# EAGLE design ledCtrl (EAGLE 6.4)
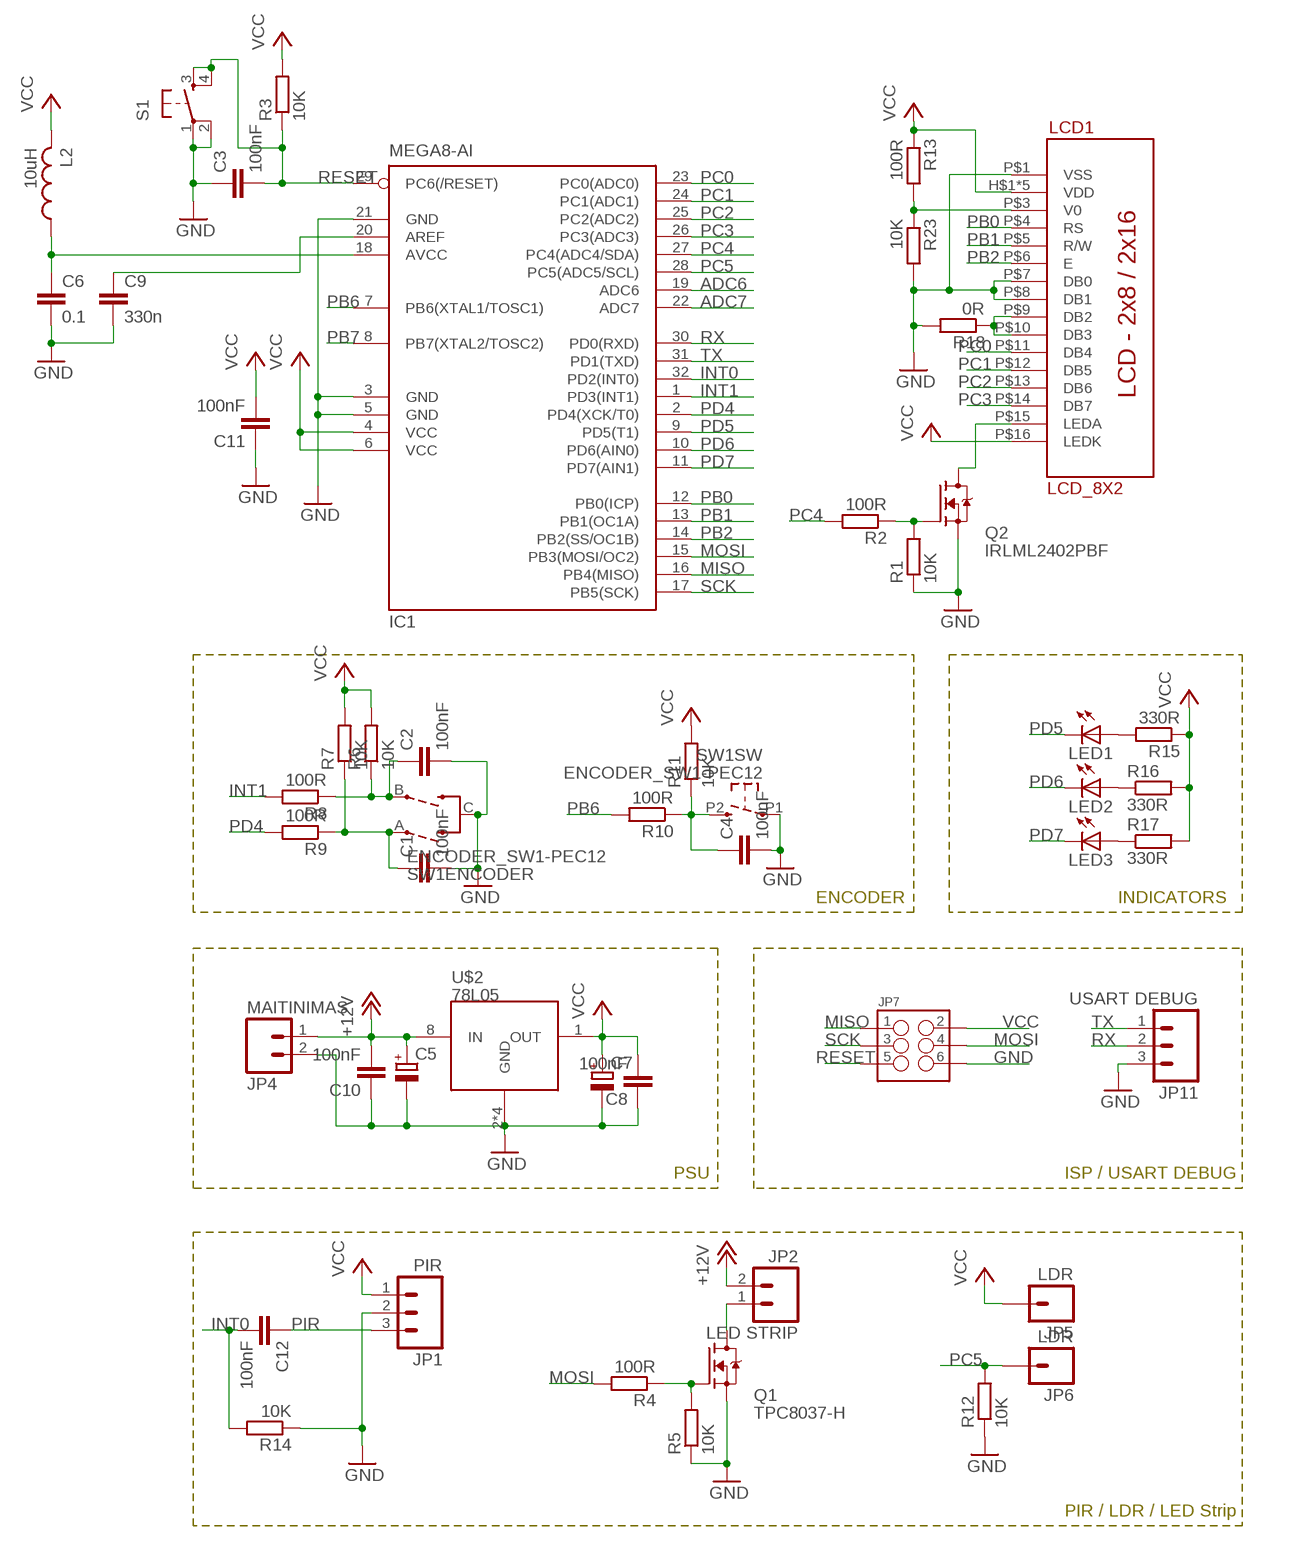
[diagram p0: schematic, sheet 1]

## Parts
C1  100nF  C-EUC0805  [C0805]
C2  100nF  C-EUC0805  [C0805]
C3  100nF  C-EUC0805  [C0805]
C4  100nF  C-EUC0805  [C0805]
C5  CPOL-EUSMCC  [SMC_C]
C6  0.1  C-EUC0805K  [C0805K]
C7  CPOL-EUSMCC  [SMC_C]
C8  100nF  C-EUC0805  [C0805]
C9  330n  C-EUC0805  [C0805]
C10  100nF  C-EUC0805  [C0805]
C11  100nF  C-EUC0805  [C0805]
C12  100nF  C-EUC0805  [C0805]
IC1  MEGA8-AI  [TQFP32-08]
JP1  PIR  M03LOCK  [1X03_LOCK]
JP2  LED STRIP  M023.5MM-NO_SILK  [SCREWTERMINAL-3.5MM-2-NS]
JP4  MAITINIMAS  M023.5MM-NO_SILK  [SCREWTERMINAL-3.5MM-2-NS]
JP5  LDR  M01PTH_LONGPAD  [1X01_LONGPAD]
JP6  LDR  M01PTH_LONGPAD  [1X01_LONGPAD]
JP7  M03X2  [2X3-SHROUDED]
JP11  USART DEBUG  M03LOCK  [1X03_LOCK]
L2  10uH  L-USL2825P  [L2825P]
LCD1  LCD_8X2  [LCD_2X8]
LED1  LEDCHIP-LED0805  [CHIP-LED0805]
LED2  LEDCHIP-LED0805  [CHIP-LED0805]
LED3  LEDCHIP-LED0805  [CHIP-LED0805]
Q1  TPC8037-H  [SO8]
Q2  IRLML2402PBF  [SOT23]
R1  10K  R-EU_M0805  [M0805]
R2  100R  R-EU_M0805  [M0805]
R3  10K  R-EU_M0805  [M0805]
R4  100R  R-EU_M0805  [M0805]
R5  10K  R-EU_M0805  [M0805]
R6  10K  R-EU_M0805  [M0805]
R7  10K  R-EU_M0805  [M0805]
R8  100R  R-EU_M0805  [M0805]
R9  100R  R-EU_M0805  [M0805]
R10  100R  R-EU_M0805  [M0805]
R11  10K  R-EU_M0805  [M0805]
R12  10K  R-EU_M1206  [M1206]
R13  100R  R-EU_M0805  [M0805]
R14  10K  R-EU_M0805  [M0805]
R15  330R  R-EU_M0805  [M0805]
R16  330R  R-EU_M0805  [M0805]
R17  330R  R-EU_M0805  [M0805]
R18  0R  R-EU_M1206  [M1206]
R23  10K  R-EU_M0805  [M0805]
S1  TAC_SWITCHPTH  [TACTILE-PTH]
SW1  ENCODER_SW1-PEC12  [PEC12_INCREMENTAL_ENCODER]
U$2  78L05  [SO8]

## Nets
+12V: C5.+ C10.2 JP2.2 JP4.1 U$2.8(IN)
ADC6: IC1.19(ADC6)
ADC7: IC1.22(ADC7)
AREF: C9.1 IC1.20(AREF)
AVCC: C6.1 IC1.18(AVCC) L2.1
GND: C1.2 C2.2 C3.1 C4.2 C5.- C6.2 C7.- C8.1 C9.2 C10.1 C11.1 IC1.3(GND) IC1.5(GND) IC1.21(GND) JP1.2 JP4.2 JP7.6 JP11.3 LCD1.P$1(VSS) LCD1.P$7(DB0) LCD1.P$8(DB1) Q1.1(S) Q1.2(S) Q1.3(S) Q2.2(S) R1.1 R5.1 R12.1 R14.1 R18.2 R23.2 S1.1 S1.2 SW1.C(ENCODER:C) SW1.P1 U$2.2(GND) U$2.3(GND) U$2.6(GND) U$2.7(GND)
INT0: C12.2 IC1.32(PD2(INT0)) R14.2
INT1: IC1.1(PD3(INT1)) R8.2
MISO: IC1.16(PB4(MISO)) JP7.1
MOSI: IC1.15(PB3(MOSI/OC2)) JP7.4 R4.2
N$1: JP2.1 Q1.5(D) Q1.6(D) Q1.7(D) Q1.8(D)
N$2: LED1.A R15.2
N$3: C2.1 R6.1 R8.1 SW1.B(ENCODER:B)
N$4: C1.1 R7.1 R9.1 SW1.A(ENCODER:A)
N$5: LED2.A R16.1
N$6: LED3.A R17.1
N$7: LCD1.P$15(LEDA) Q2.3(D)
N$8: Q2.1(G) R1.2 R2.1
N$11: Q1.4(G) R4.1 R5.2
N$12: C4.1 R10.1 R11.1 SW1.P2
N$15: LCD1.P$9(DB2) LCD1.P$10(DB3) R18.1
N$20: LCD1.P$3(V0) R13.2 R23.1
PB0: IC1.12(PB0(ICP)) LCD1.P$4(RS)
PB1: IC1.13(PB1(OC1A)) LCD1.P$5(R/W)
PB2: IC1.14(PB2(SS/OC1B)) LCD1.P$6(E)
PB6: IC1.7(PB6(XTAL1/TOSC1)) R10.2
PB7: IC1.8(PB7(XTAL2/TOSC2))
PC0: IC1.23(PC0(ADC0)) LCD1.P$11(DB4)
PC1: IC1.24(PC1(ADC1)) LCD1.P$12(DB5)
PC2: IC1.25(PC2(ADC2)) LCD1.P$13(DB6)
PC3: IC1.26(PC3(ADC3)) LCD1.P$14(DB7)
PC4: IC1.27(PC4(ADC4/SDA)) R2.2
PC5: IC1.28(PC5(ADC5/SCL)) JP6.1 R12.2
PD4: IC1.2(PD4(XCK/T0)) R9.2
PD5: IC1.9(PD5(T1)) LED1.C
PD6: IC1.10(PD6(AIN0)) LED2.C
PD7: IC1.11(PD7(AIN1)) LED3.C
PIR: C12.1 JP1.3
RESET: C3.2 IC1.29(PC6(/RESET)) JP7.5 R3.1 S1.3 S1.4
RX: IC1.30(PD0(RXD)) JP11.2
SCK: IC1.17(PB5(SCK)) JP7.3
TX: IC1.31(PD1(TXD)) JP11.1
VCC: C7.+ C8.2 C11.2 IC1.4(VCC) IC1.6(VCC) JP1.1 JP5.1 JP7.2 L2.2 LCD1.H$1(VDD) LCD1.H$2(VDD) LCD1.H$3(VDD) LCD1.H$4(VDD) LCD1.P$2(VDD) LCD1.P$16(LEDK) R3.2 R6.2 R7.2 R11.2 R13.1 R15.1 R16.2 R17.2 U$2.1(OUT)

## Notes on the sheet
- ENCODER | INDICATORS
- PSU | ISP / USART DEBUG
- PIR / LDR / LED Strip

## Library data of the parts
C1-C4 C6 C8-C12 = rcl:C-EU: CAPACITOR, European symbol
C5 C7 = rcl:CPOL-EU: POLARIZED CAPACITOR, European symbol
IC1 = atmel:MEGA8: MICROCONTROLLER 8 Kbytes FLASH, 1 kbytes SRAM, 512 bytes EEPROM, USART, 6-channel 10 bit ADC, 2-channel 8 bit ADC Pin compatible with Atmega48, ATMega88, ATMega168 Source: avr.lbr; MPN: ATMEGA8-16AU; OC_FARNELL: 9171371; OC_NEWARK: 73M8863
JP1 JP11 = SparkFun:M03: Header 3 Standard 3-pin 0.1" header. Use with straight break away headers (SKU : PRT-00116), right angle break away headers (PRT-00553), swiss pins (PRT-00743), machine pins (PRT-00117), and female headers (PRT-00115). Molex polarized connector foot print use with SKU : PRT-08232 with associated crimp pins and housings.
JP2 JP4 = SparkFun:M02: Header 2 Standard 2-pin 0.1" header. Use with straight break away headers (SKU : PRT-00116), right angle break away headers (PRT-00553), swiss pins (PRT-00743), machine pins (PRT-00117), and female headers (PRT-00115). Molex polarized connector foot print use with SKU : PRT-08233 with associated crimp pins and housings.
JP5 JP6 = SparkFun-Connectors:M01: Header 1 Standard 1-pin 0.1" header. Use with straight break away headers (SKU : PRT-00116), right angle break away headers (PRT-00553), swiss pins (PRT-00743), machine pins (PRT-00117), and female headers (PRT-00115).
JP7 = SparkFun-Connectors:M03X2: 2x3 .1" header. Shrouded, with keying- CONN-10681 SMT- CONN-11415 Pogo pins- HW-11044; PROD_ID: CONN-10681
L2 = rcl:L-US: INDUCTOR, American symbol
LCD1 = custom_parts:LCD_8X2
LED1-LED3 = led:LED: LED OSRAM: - CHIPLED LG R971, LG N971, LY N971, LG Q971, LY Q971, LO R971, LY R971 LH N974, LH R974 LS Q976, LO Q976, LY Q976 LO Q996 - Hyper CHIPLED LW Q18S LB Q993, LB Q99A, LB R99A - SideLED LS A670, LO A670, LY A670, LG A670, LP A670 LB A673, LV A673, LT A673, LW A673 LH A674 LY A675 LS A676, LA A676, LO A676, LY A676, LW A676 LS A679, LY A679, LG A679 - Hyper Micro SIDELED® LS Y876, LA Y876, LO Y876, LY Y876 LT Y87S - SmartLED LW L88C, LW L88S LB L89C, LB L89S, LG L890 LS L89K, LO L89K, LY L89K LS L896, LA L896, LO L896, LY L896 - TOPLED LS T670, LO T670, LY T670, LG T670, LP T670 LSG T670, LSP T670, LSY T670, LOP T670, LYG T670 LG T671, LOG T671, LSG T671 LB T673, LV T673, LT T673, LW T673 LH T674 LS T676, LA T676, LO T676, LY T676, LB T676, LH T676, LSB T676, LW T676 LB T67C, LV T67C, LT T67C, LS T67K, LO T67K, LY T67K, LW E67C LS E67B, LA E67B, LO E67B, LY E67B, LB E67C, LV E67C, LT E67C LW T67C LS T679, LY T679, LG T679 LS T770, LO T770, LY T770, LG T770, LP T770 LB T773, LV T773, LT T773, LW T773 LH T774 LS E675, LA E675, LY E675, LS T675 LS T776, LA T776, LO T776, LY T776, LB T776 LHGB T686 LT T68C, LB T68C - Hyper Mini TOPLED® LB M676 - Mini TOPLED Santana® LG M470 LS M47K, LO M47K, LY M47K Source: http://www.osram.convergy.de LUXEON: - LUMILED® LXK2-PW12-R00, LXK2-PW12-S00, LXK2-PW14-U00, LXK2-PW14-V00 LXK2-PM12-R00, LXK2-PM12-S00, LXK2-PM14-U00 LXK2-PE12-Q00, LXK2-PE12-R00, LXK2-PE12-S00, LXK2-PE14-T00, LXK2-PE14-U00 LXK2-PB12-K00, LXK2-PB12-L00, LXK2-PB12-M00, LXK2-PB14-N00, LXK2-PB14-P00, LXK2-PB14-Q00 LXK2-PR12-L00, LXK2-PR12-M00, LXK2-PR14-Q00, LXK2-PR14-R00 LXK2-PD12-Q00, LXK2-PD12-R00, LXK2-PD12-S00 LXK2-PH12-R00, LXK2-PH12-S00 LXK2-PL12-P00, LXK2-PL12-Q00, LXK2-PL12-R00 Source: www.luxeon.com KINGBRIGHT: KA-3528ASYC Source: www.kingbright.com
Q1 = cs5463:TPC8037-H
Q2 = cs5463:IRLML2402PBF
R1-R18 R23 = rcl:R-EU_: RESISTOR, European symbol
S1 = SparkFun-Electromechanical:TAC_SWITCH: Momentary Switch Button commonly used for reset or general input. Spark Fun Electronics SKU : COM-00097 SMT- SWCH-08247
SW1 = dp_devices:ENCODER_SW1: Incremental Encoder with push switch
U$2 = cs5463:78L05

## Board
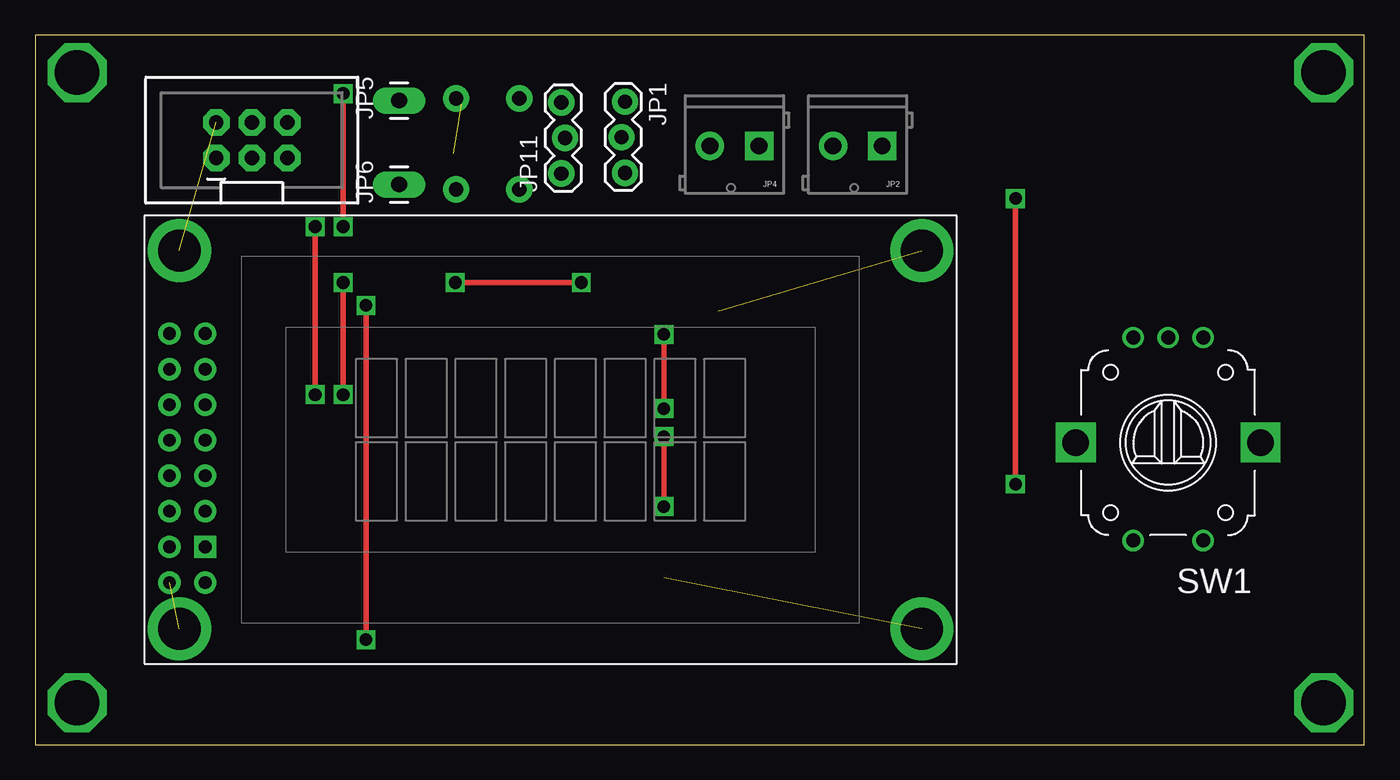
[diagram p1: board, top side]
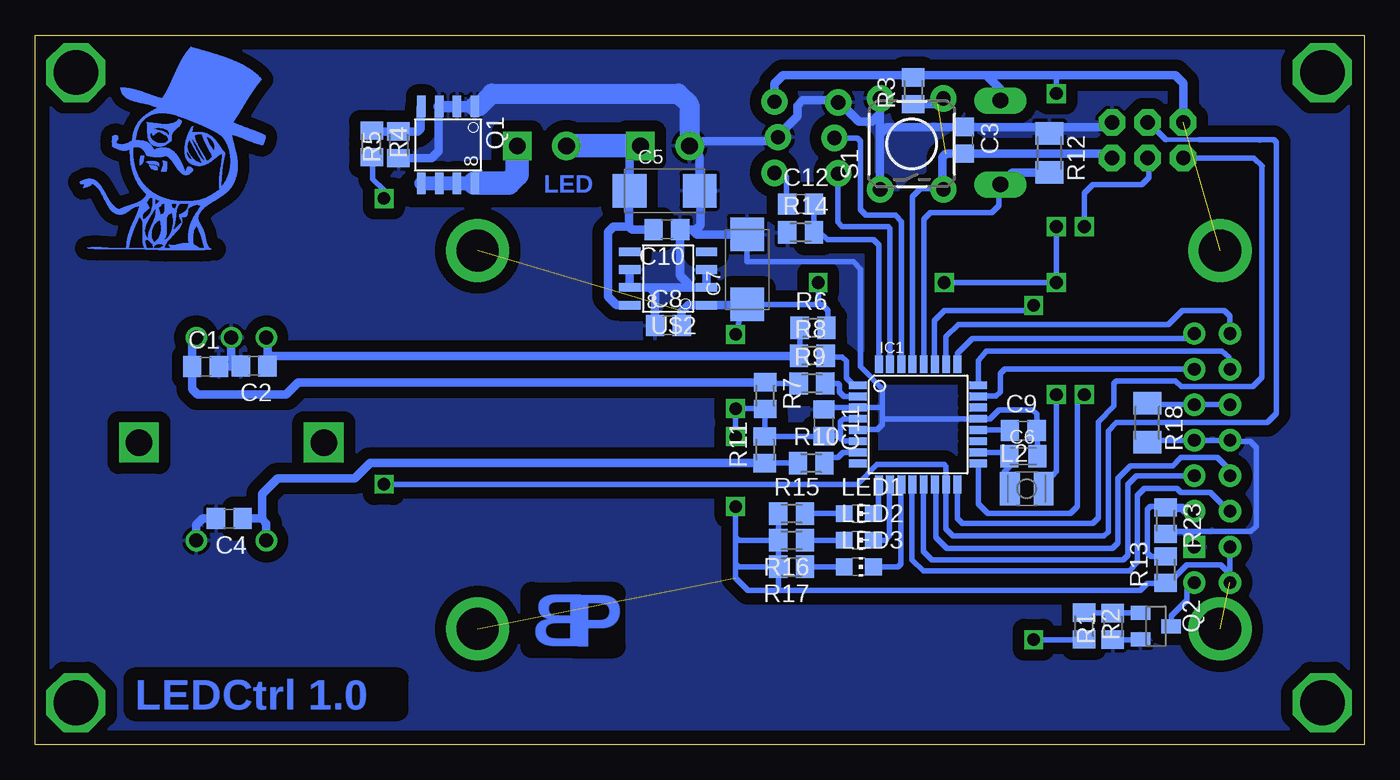
[diagram p2: board, bottom side, seen from below]

Size 94.92 x 50.68 mm. Coordinates in mm from the lower left corner, seen from the top.
Outline: 0,0 94.92,0 94.92,50.68 0,50.68 0,0
Copper layers (1*16): Top 0.035mm / dielectric 1.5mm / Bottom 0.035mm
Design rules "default": minimum track width 10mil, minimum drill 24mil, track to track 8mil, track to pad 8mil, pad to pad 8mil, via to via 8mil, smd to smd 8mil, copper to edge 40mil, drill to drill 8mil, minimum pad ring 10mil, minimum via ring 8mil, stop-mask expansion 4mil, vias tented up to drill 0mil, thermal gap 10mil
bRestrict: area 23,24 to 25,26; area 54.9,39.3 to 68,40; area 14,21.6 to 16.5,21.6; area 14,20.3 to 16.5,22.9

### Footprints (pad centres in the part's own frame; a part is rotated, then mirrored left to right if it is on the bottom)
C0805 = smd 1.3 x 1.5: 1 -0.95,0; 2 0.95,0
SMC_C = smd 2.4 x 2.4: + -2.5,0; - 2.5,0
C0805K = smd 1.3 x 1.6: 1 -1,0; 2 1,0
TQFP32-08 = smd 1.27 x 0.559: 1 -4.293,2.8; 2 -4.293,2; 3 -4.293,1.2; 4 -4.293,0.4; 5 -4.293,-0.4; 6 -4.293,-1.2; 7 -4.293,-2; 8 -4.293,-2.8; 17 4.293,-2.8; 18 4.293,-2; 19 4.293,-1.2; 20 4.293,-0.4; 21 4.293,0.4; 22 4.293,1.2; 23 4.293,2; 24 4.293,2.8 | smd 0.559 x 1.27: 9 -2.8,-4.293; 10 -2,-4.293; 11 -1.2,-4.293; 12 -0.4,-4.293; 13 0.4,-4.293; 14 1.2,-4.293; 15 2,-4.293; 16 2.8,-4.293; 25 2.8,4.293; 26 2,4.293; 27 1.2,4.293; 28 0.4,4.293; 29 -0.4,4.293; 30 -1.2,4.293; 31 -2,4.293; 32 -2.8,4.293
1X03_LOCK = drill 1.016 pad 1.88: 1 0,0.127; 2 2.54,-0.127; 3 5.08,0.127
SCREWTERMINAL-3.5MM-2-NS = drill 1.2 pad 2.032 square: 1 0,0 | drill 1.2 pad 2.032: 2 3.5,0
1X01_LONGPAD = drill 1.118 pad 1.88 long: 1 0,0
2X3-SHROUDED = drill 1.016 pad 1.88 octagon: 1 -1.27,2.54; 2 1.27,2.54; 3 -1.27,0; 4 1.27,0; 5 -1.27,-2.54; 6 1.27,-2.54
L2825P = smd 1.4 x 2.4: 1 -1.2,0; 2 1.2,0
LCD_2X8 = drill 3 pad 4.5: H$1 2.5,2.5; H$2 55.5,2.5; H$3 55.5,29.5; H$4 2.5,29.5 | drill 0.9 pad 1.6 square: P$1 4.34,8.34 | drill 0.9 pad 1.6: P$2 1.8,8.34; P$3 4.34,10.88; P$4 1.8,10.88; P$5 4.34,13.42; P$6 1.8,13.42; P$7 4.34,15.96; P$8 1.8,15.96; P$9 4.34,18.5; P$10 1.8,18.5; P$11 4.34,21.04; P$12 1.8,21.04; P$13 4.34,23.58; P$14 1.8,23.58; P$15 4.34,5.8; P$16 1.8,5.8
CHIP-LED0805 = smd 1.2 x 1.2: A 0,-1.05; C 0,1.05
SO8 = smd 1.524 x 0.61: 1 -2.743,1.905; 2 -2.743,0.635; 3 -2.743,-0.635; 4 -2.743,-1.905; 5 2.743,-1.905; 6 2.743,-0.635; 7 2.743,0.635; 8 2.743,1.905
SOT23 = smd 1 x 1.4: 1 -0.95,-1.1; 2 0.95,-1.1; 3 0,1.1
M0805 = smd 1.3 x 1.6: 1 -0.95,0; 2 0.95,0
M1206 = smd 1.6 x 2: 1 -1.4,0; 2 1.4,0
TACTILE-PTH = drill 1.016 pad 1.88: 1 -3.251,2.261; 2 3.251,2.261; 3 -3.251,-2.261; 4 3.251,-2.261
PEC12_INCREMENTAL_ENCODER = drill 1: A -2.5,-7.5; B 2.5,-7.5; C 0,-7.5; P1 -2.5,7; P2 2.5,7 | drill 1.9 square: GND@1 -6.6,0; GND@2 6.6,0

### Placement (x,y rotation side)
C1  82.74,26.99 0 bottom
C2  79.28,27.05 180 bottom
C3  28.65,43.16 270 bottom
C4  81.05,16.15 180 bottom
C5  49.97,39.56 0 bottom
C6  24.36,20.6 0 bottom
C7  44.07,33.94 90 bottom
C8  49.7,29.93 0 bottom
C9  24.36,22.43 0 bottom
C10  49.8,36.79 180 bottom
C11  38.6,22.98 270 bottom
C12  40.26,38.61 0 bottom
IC1  31.87,22.87 0 bottom
JP1  42,45.92 270 top
JP2  60.48,42.76 180 top
JP4  51.69,42.76 180 top
JP5  26,46 90 top
JP6  26,40 90 top
JP7  15.48,43.17 90 top
JP11  37.71,40.79 90 top
L2  24.12,18.28 0 bottom
LCD1  7.81,5.78 0 top
LED1  36.1,16.5 270 bottom
LED2  36.1,14.6 270 bottom
LED3  36.1,12.7 270 bottom
Q1  65.43,42.83 270 bottom
Q2  14.9,8.46 270 bottom
R1  17.97,8.45 90 bottom
R2  20.02,8.48 270 bottom
R3  32.22,46.69 90 bottom
R4  70.88,42.9 270 bottom
R5  68.97,42.84 90 bottom
R6  39.37,29.76 0 bottom
R7  42.78,24.93 270 bottom
R8  39.42,27.77 0 bottom
R9  39.45,25.79 0 bottom
R10  39.5,20.1 0 bottom
R11  42.81,21.05 90 bottom
R12  22.49,42.26 270 bottom
R13  14.2,12.5 90 bottom
R14  40.26,36.58 0 bottom
R15  40.9,16.5 0 bottom
R16  40.9,14.6 180 bottom
R17  40.9,12.7 180 bottom
R18  15.51,22.99 270 bottom
R23  14.2,16 270 bottom
S1  32.32,42.9 90 bottom
SW1  80.9,21.57 180 top
U$2  49.72,33.29 180 bottom
U$3  [TROLIS6]  76,35 0 top

### Tracks (layer width: path | path; a pad name or v marks a point on that pad's centre or on a via)
+12V
  Bottom 0.61: JP4.1 52.47,41.98 C5.+ 52.5,39.53 52.5,37 | C10.2 52.29,36.79 52.5,37 | U$2.8 53.39,31.39 54,32 54,36.6 53.6,37 52.5,37
  Bottom 1.676: JP4.1 JP2.2
AREF
  Bottom 0.406: IC1.20 25.35,22.47 C9.1
AVCC
  Bottom 0.406: IC1.18 25.63,20.87 C6.1 25.36,19.84 25.7,19.5 25.7,18.4 L2.1
GND
  Bottom 0.406: IC1.5 36.13,22.5 34.78,22.5 34.41,22.87 34.41,23.18 | 34.41,24.14 34.41,25.41 34.44,25.41 34.44,25.44 36,27 36,33.98 36.5,34.48 43.95,34.48 44.1,34.5 44.1,36.41 C7.- | 34.41,24.14 34.41,23.18 | 34.41,24.14 34.48,24.07 IC1.3 36.17,24.08 38,24.08 38.15,23.93 C11.1 | C6.2 23.36,22.38 C9.2 23.4,23.6 23.7,23.9 26.1,23.9 26.73,23.27 IC1.21 34.32,23.27 34.41,23.18 | R1.1 16,7.5 Q2.2 | 12.32,14.99 12.32,14.29 LCD1.P$1 12.15,14.44 12.95,15.24 | 12.95,15.24 13.69,15.24 13.85,15.4 R23.2 | R18.2 15.35,21.74 LCD1.P$7 LCD1.P$8 9.53,21.66 8.16,21.66 7.74,21.24 7.74,15.6 8.1,15.24 12.95,15.24
  Bottom 0.61: U$2.6 U$2.7 51,32.66 | U$2.3 U$2.2 48,32.66 | 48,32.66 51,32.66 | S1.1 34.58,43.61 | 34.58,43.61 34.58,45.1 | 34.58,45.1 S1.2 | 37.63,45.92 JP11.3 | JP11.3 37.47,45.87 36.1,44.5 35.18,44.5 34.58,45.1 | 22,44.11 C3.1 34.08,44.11 34.58,43.61 | 22,44.11 18.35,44.11 JP7.6 | JP11.3 37.74,46.02 40.12,46.02 40.5,45.64 40.5,44.88 41.87,43.5 JP1.2 42.15,43.1 47.23,43.1 47.57,42.76 JP4.2 47.47,42.04 C5.- 47.4,39.49 47.4,37.1 47.71,36.79 48,36.79 | 48,32.66 48.85,33.51 C10.1 48,36.79 | C8.1 50.65,32.3 51,32.66 | R12.1 22.45,43.66 22,44.11 | R5.1 66.61,41.89 66.1,42.4 66.1,45.54 Q1.3 | C7.- 47.65,36.44 48,36.79 | C4.2 82.95,16.15 83.4,15.7 SW1.P1 | C1.2 80.28,26.99 C2.2 80.35,27.05 80.9,27.6 SW1.C
  Bottom 0.813: Q1.1 Q1.2 Q1.3
  Bottom 1.422: Q1.1 63.23,45.57 62.3,46.5 49,46.5 48.2,45.7 JP4.2
  pour Bottom (isolate 0.813): 0,49.73 95,51 95,0 0,-1.27
INT0
  Bottom 0.406: IC1.32 34.67,35.67 35.07,36.07 38.35,36.07 38.86,36.58 R14.2 C12.2
INT1
  Bottom 0.406: IC1.1 36.47,25.67 37,26.2 37,27.4 37.3,27.7 38.4,27.7 R8.2
MISO
  Bottom 0.406: IC1.16 29.07,16.17 28.7,15.8 19.4,15.8 19,16.2 19,23.06 17.88,24.18 17.88,25.8 17.7,25.98 13.5,25.98 13.08,25.56 7.98,25.56 7.32,26.22 7.32,41.28 7.3,41.3 7.9,41.9 JP7.1
MOSI  (via drill 0.9 pad 0.81)
  Top 0.406: v70,18.6 v70,39
  Bottom 0.305: 14.2,43.2 11.8,43.2 11.4,43.2
  Bottom 0.406: v70,18.6 36.2,18.6 34.8,20 30,20 29.87,19.87 IC1.15 29.9,18.55 29.9,15.4 29.4,14.9 18.6,14.9 18.3,15.2 18.3,22.4 17.7,23 6.94,23 6.3,23.64 6.3,43.02 6.48,43.2 7.46,43.2 7.48,43.18 7.5,43.2 11.8,43.2 | v70,39 70,39.6 70.8,40.4 70.8,41.83 R4.2 | JP7.4 15.44,44.44 14.2,43.2
N$1
  Bottom 1.016: Q1.5 Q1.6 Q1.7 Q1.8
  Bottom 1.676: Q1.8 61.11,40.09 60.5,40.7 60.5,42.74 JP2.1
N$2
  Bottom 0.406: R15.2 LED1.A
N$3
  Bottom 0.406: R6.1 40.32,27.82 R8.1
  Bottom 0.61: C2.1 78.33,28 | 78.33,28 78.33,29 SW1.B | R8.1 78.1,27.77 78.33,28
N$4
  Bottom 0.406: R9.1 42.69,25.79 R7.1
  Bottom 0.61: SW1.A 83.69,28.78 C1.1 83.7,25.4 83.3,25 77,25 76.12,25.88 R7.1
N$5
  Bottom 0.406: LED2.A R16.1
N$6
  Bottom 0.406: LED3.A R17.1
N$7
  Bottom 0.406: Q2.3 13.8,9.19 12.7,10.29 12.7,11.03 LCD1.P$15
N$8
  Bottom 0.406: 16,9.4 Q2.1 R1.2 18,9.43 R2.1
N$9  (via drill 3.2 pad 3.81)
  other vias: 3,48
N$10  (via drill 3.2 pad 3.81)
  other vias: 92,48
N$11
  Bottom 0.61: Q1.4 67.4,45.51 67.4,44 67.61,43.79 R5.2 70.62,43.79 R4.1
N$12
  Bottom 0.406: R10.1 R11.1
  Bottom 0.61: C4.1 78.75,16.15 | 78.75,16.15 78.4,15.8 SW1.P2 | R11.1 71,20.1 72.1,19 77.6,19 78.7,17.9 78.7,16.2 78.75,16.15
N$13  (via drill 3.2 pad 3.81)
  other vias: 3,3
N$14  (via drill 3.2 pad 3.81)
  other vias: 92,3
N$15
  Bottom 0.406: LCD1.P$10 LCD1.P$9 15.4,24.28 R18.1
N$20
  Bottom 0.406: R13.2 15.25,13.45 15.5,13.7 15.5,16.8 15.3,17 14.25,17 R23.1
  Bottom 0.61: LCD1.P$3 12.76,16.66 13,16.9 14.15,16.9 R23.1
PB0
  Bottom 0.406: LCD1.P$4 9.66,16.66 11,18 13.1,18 13.4,18.3 15.7,18.3 16.2,17.8 16.2,13 16.8,12.4 31.5,12.4 32.3,13.2 32.3,18.55 IC1.12
PB1
  Bottom 0.406: LCD1.P$5 16.3,19.2 16.9,18.6 16.9,13.5 17.2,13.2 30.9,13.2 31.5,13.8 31.5,18.55 IC1.13
PB2
  Bottom 0.406: LCD1.P$6 9.61,19.61 10.5,20.5 13.1,20.5 13.7,19.9 16.7,19.9 17.6,19 17.6,14.4 18,14 29.8,14 30.6,14.8 30.6,18.51 IC1.14
PB6
  Bottom 0.406: IC1.7 37.23,20.87 37.6,20.5 38,20.5 | 38,20.5 38.15,20.5 | R10.2 38.4,20.1 38,20.5
PC0
  Bottom 0.406: LCD1.P$11 25.68,26.82 26,26.5 26,25.2 26.3,24.9 27.55,24.9 IC1.23
PC1
  Bottom 0.406: IC1.24 27.58,27.42 27,28.1 10.2,28.1 9.7,27.7 9.7,26.91 LCD1.P$12
PC2
  Bottom 0.406: IC1.25 29.07,27.93 28,29 12.51,29
  Bottom 0.61: 12.51,29 LCD1.P$13
PC3
  Bottom 0.406: IC1.26 29.87,29.13 29,30 14,30 13,31 10,31 9.6,30.6 LCD1.P$14
  Bottom 0.61: LCD1.P$14
PC4  (via drill 0.9)
  Top 0.406: v23.62,31.37 v23.62,7.49
  Bottom 0.406: IC1.27 30.7,27.19 30.7,30.3 30,31 23.99,31 v23.62,31.37 | v23.62,7.49 20.05,7.49 R2.2
PC5
  Bottom 0.406: IC1.28 31.47,37.53 31,38 26.6,38 26.1,38.5 26.1,39.9 JP6.1
  Bottom 0.61: R12.2 25.14,40.85 JP6.1
PD4
  Bottom 0.406: IC1.2 37.17,24.87 37.5,25.2 37.5,25.7 37.6,25.8 R9.2
PD5
  Bottom 0.406: LED1.C 35,16.5 34.7,16.8 34.7,18.55 IC1.9
PD6
  Bottom 0.406: LED2.C 34.2,14.6 33.9,14.9 33.9,18.55 IC1.10
PD7
  Bottom 0.406: LED3.C 33.3,12.7 33.1,12.9 33.1,18.55 IC1.11
PIR
  Bottom 0.406: JP1.3 41.6,40.84 41.27,40.51 41.27,38.67 C12.1
RESET  (1 unrouted)
  Bottom 0.406: IC1.29 32.27,39.13 31.7,39.7 30.11,39.7 S1.3
  Bottom 0.61: JP7.5 18.33,42.21 C3.2 29.88,42.21 30.13,41.96 30.13,39.72 S1.3 | R3.1 30.47,45.74 S1.4
RX
  Bottom 0.406: IC1.30 33.07,37.37 33.5,37.8 35.6,37.8 36,38.2 36,43.1 36.2,43.3 37.81,43.3 JP11.2
SCK  (via drill 0.9 pad 0.81)
  Top 0.406: v20,25 v20,37
  Bottom 0.406: IC1.17 27.58,17.18 26.9,16.5 21,16.5 20.5,17 20.5,24.4 v20,25 | v20,37 20,39.4 19.4,40 15.9,40 15.4,40.5 15.4,41.82 JP7.3
TX
  Bottom 0.406: IC1.31 33.87,36.87 34,37 37.3,37 37.6,37.3 37.6,40.77 JP11.1
VCC  (via drill 0.9, 0.9 pad 0.81)  (4 unrouted)
  Top 0.406: v44.9,24 v44.9,29.3 | v22,25 v22,33 | v22,37 v22,46.5 | v30,33 v39,33 | v44.9,22 v44.9,17
  Bottom 0.406: IC1.4 37.21,23.27 37.4,23.08 37.4,22.38 | 37.4,22.38 37.4,21.88 37.2,21.68 36.17,21.68 IC1.6 | 37.4,22.38 37.75,22.03 C11.2 38.63,22 R11.2 42.81,23.95 R7.2 42.8,24 v44.9,24 v44.9,22 | 39,31.44 C7.+ 44.4,31.11 v44.9,29.3 | 39,31.44 38.74,31.44 38.3,31 38.3,29.88 R6.2 | L2.2 23.42,18.88 23.1,19.2 22.3,19.2 22,19.5 v22,25 22,25.5 | v22,46.5 22,47.8 | v30,33 v22,33 v22,37 | v39,33 39,31.44 | v44.9,17 44.9,14.8 | 44.9,14.8 44.9,12.9 | 44.9,12.9 44.9,11.9 44,11 42,11 | 42,11 16,11 15.5,11.5 14.25,11.5 R13.1 13.98,11.55 12.7,12.83 10.24,12.83 9.61,12.19 | R17.2 41.85,11.15 42,11 | R17.2 44.7,12.7 44.9,12.9 | R16.2 R17.2 | R16.2 44.7,14.6 44.9,14.8 | R15.1 R16.2 | LCD1.P$2 9.61,12.19 | 9.61,12.19 LCD1.P$16
  Bottom 0.61: JP7.2 12.94,47.24 13.5,47.8 22,47.8 27,47.8 | 27,47.8 32.29,47.8 | 32.29,47.8 34.11,47.8 | JP1.1 42.13,47.19 41.51,47.8 32.29,47.8 | R3.2 32.22,47.73 32.29,47.8 | C8.2 48.74,30.95 48.3,31.4 46.99,31.4 U$2.1 44.12,31.39 C7.+ | JP5.1 26,46.8 27,47.8

### Text on the board
Bottom: LED | B | P | LEDCtrl 1.0